# EAGLE design openTPM-v37 (EAGLE 8.4.3)
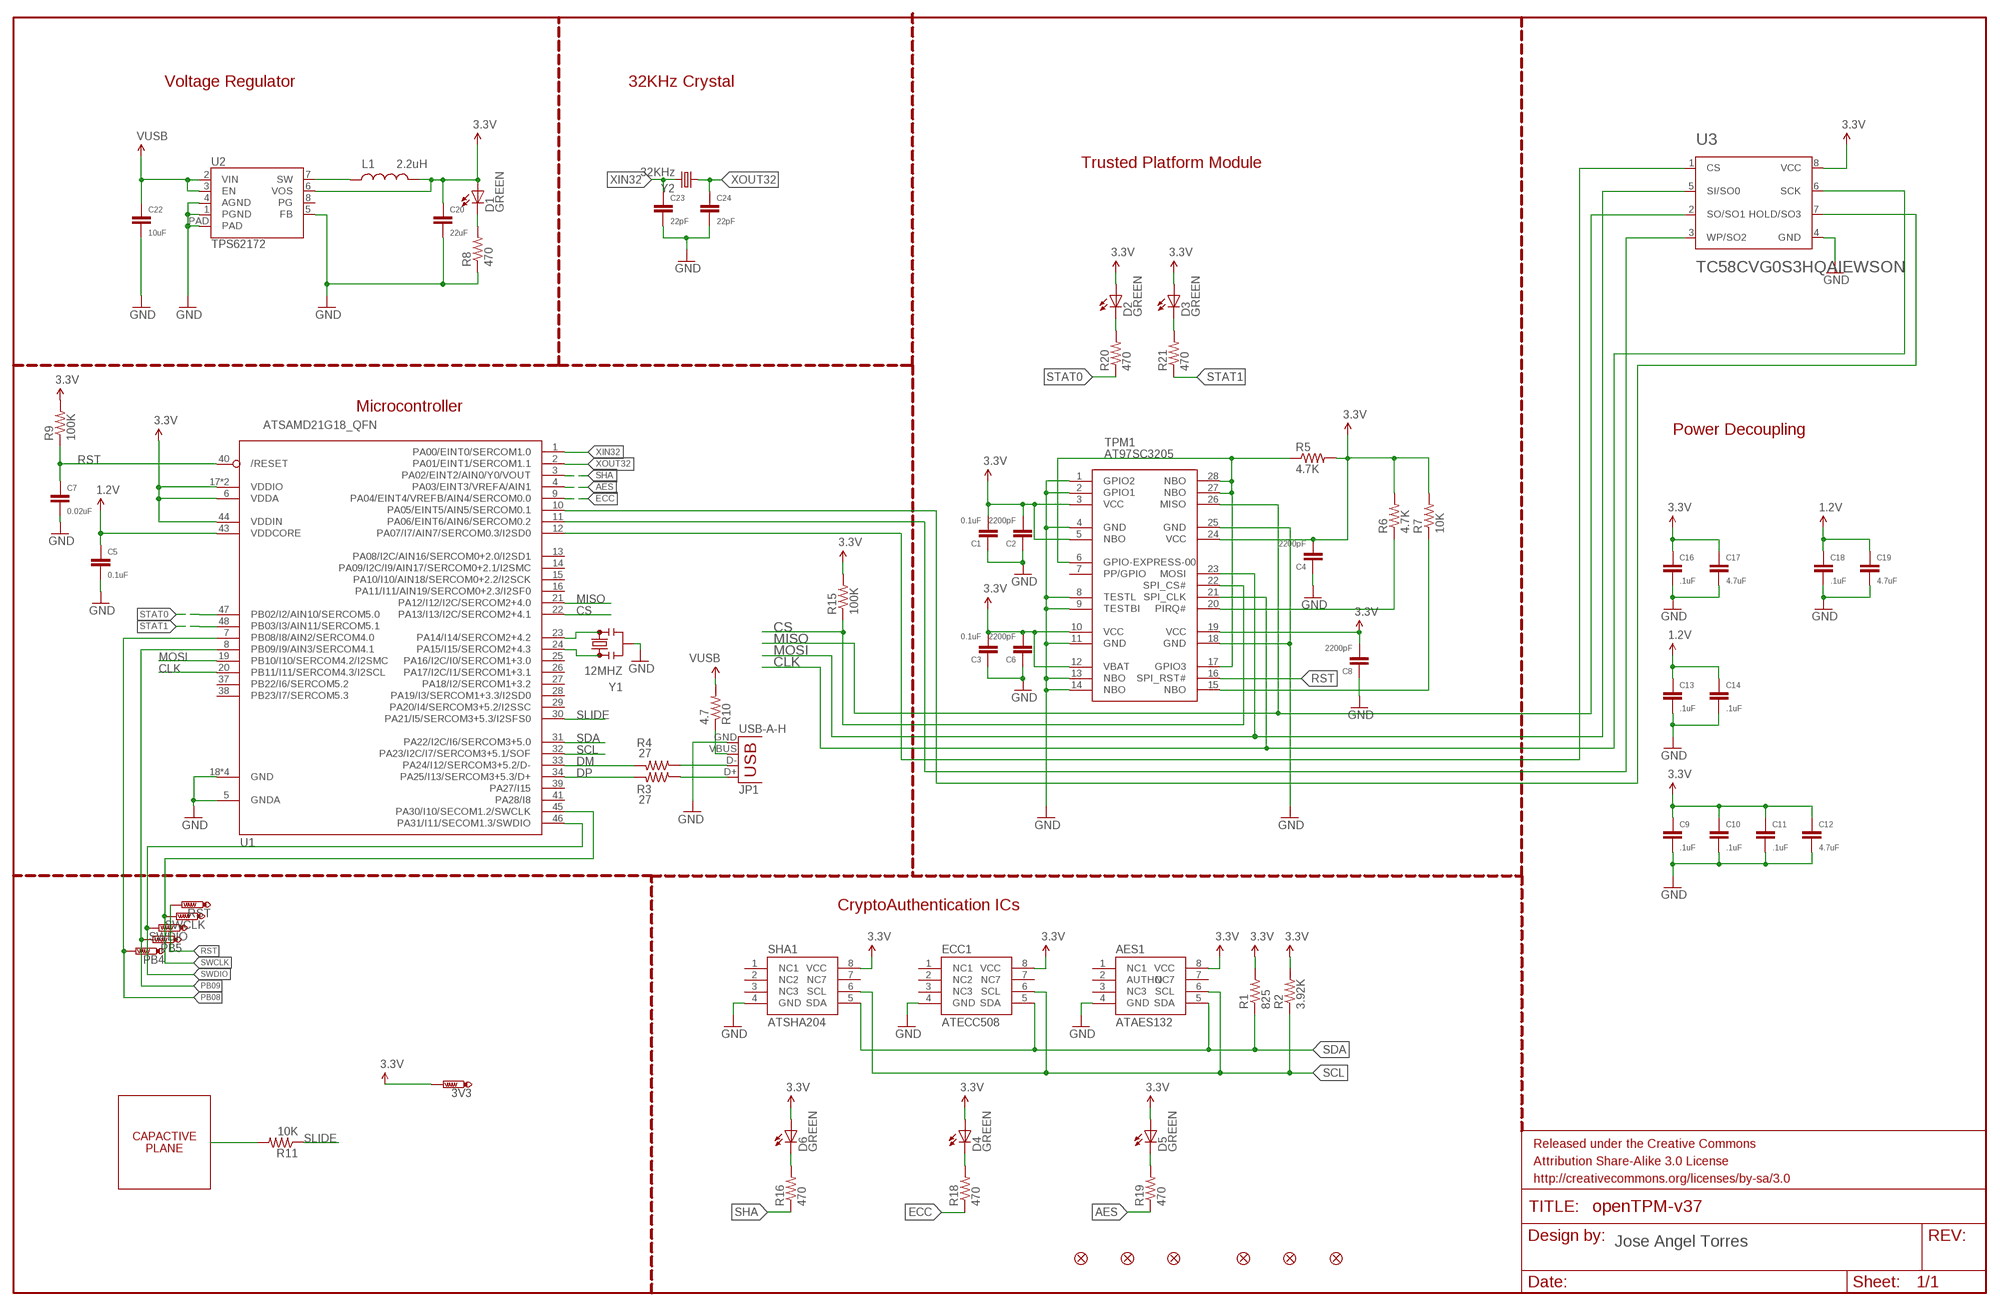
[diagram p0: schematic, sheet 1]

## Parts
3V3  PTR1B1,27  [B1,27]
AES1  ATAES132  CRYPTOTRONIX_ATAES132  [CRYPTOTRONIX_SOIC8]
C1  0.1uF  CAPACITOR.0402  [0402]
C2  2200pF  CAPACITOR.0402  [0402]
C3  0.1uF  CAPACITOR.0402  [0402]
C4  2200pF  CAPACITOR.0402  [0402]
C5  0.1uF  CAPACITOR.0402  [0402]
C6  2200pF  CAPACITOR.0402  [0402]
C7  0.02uF  CAPACITOR.0402  [0402]
C8  2200pF  CAPACITOR.0402  [0402]
C9  .1uF  CAPACITOR.0402  [0402]
C10  .1uF  CAPACITOR.0402  [0402]
C11  .1uF  CAPACITOR.0402  [0402]
C12  4.7uF  CAPACITOR.0402  [0402]
C13  .1uF  CAPACITOR.0402  [0402]
C14  .1uF  CAPACITOR.0402  [0402]
C16  .1uF  CAPACITOR.0402  [0402]
C17  4.7uF  CAPACITOR.0402  [0402]
C18  .1uF  CAPACITOR.0402  [0402]
C19  4.7uF  CAPACITOR.0402  [0402]
C20  22uF  CAPACITOR.0603  [0603]
C22  10uF  CAPACITOR.0402  [0402]
C23  22pF  CAPACITOR.0402  [0402]
C24  22pF  CAPACITOR.0402  [0402]
D1  GREEN  SPARKFUN-LED_LED-GREEN0603  [SPARKFUN-LED_LED-0603]
D2  GREEN  SPARKFUN-LED_LED-GREEN0603  [SPARKFUN-LED_LED-0603]
D3  GREEN  SPARKFUN-LED_LED-GREEN0603  [SPARKFUN-LED_LED-0603]
D4  GREEN  SPARKFUN-LED_LED-GREEN0603  [SPARKFUN-LED_LED-0603]
D5  GREEN  SPARKFUN-LED_LED-GREEN0603  [SPARKFUN-LED_LED-0603]
D6  GREEN  SPARKFUN-LED_LED-GREEN0603  [SPARKFUN-LED_LED-0603]
ECC1  ATECC508  [CRYPTOTRONIX_SOIC8]
FID1  SPARKFUN-AESTHETICS_FIDUCIAL1X2  [SPARKFUN-AESTHETICS_FIDUCIAL-1X2]
FID2  SPARKFUN-AESTHETICS_FIDUCIAL1X2  [SPARKFUN-AESTHETICS_FIDUCIAL-1X2]
FID3  SPARKFUN-AESTHETICS_FIDUCIAL1X2  [SPARKFUN-AESTHETICS_FIDUCIAL-1X2]
FID4  SPARKFUN-AESTHETICS_FIDUCIAL1X2  [SPARKFUN-AESTHETICS_FIDUCIAL-1X2]
FID5  SPARKFUN-AESTHETICS_FIDUCIAL1X2  [SPARKFUN-AESTHETICS_FIDUCIAL-1X2]
FID6  SPARKFUN-AESTHETICS_FIDUCIAL1X2  [SPARKFUN-AESTHETICS_FIDUCIAL-1X2]
JP1  USB-A-H  [USB-A-H]
L1  2.2uH  INDUCTOR0402  [C0402]
PB4  PTR1B1,27  [B1,27]
PB5  PTR1B1,27  [B1,27]
R1  825  RESISTOR.0402  [0402]
R2  3.92K  RESISTOR.0402  [0402]
R3  27  RESISTOR.0402  [0402]
R4  27  RESISTOR.0402  [0402]
R5  4.7K  RESISTOR.0402  [0402]
R6  4.7K  RESISTOR.0402  [0402]
R7  10K  RESISTOR.0402  [0402]
R8  470  RESISTOR.0402  [0402]
R9  100K  RESISTOR.0402  [0402]
R10  4.7  RESISTOR.0402  [0402]
R11  10K  RESISTOR.0402  [0402]
R15  100K  RESISTOR.0402  [0402]
R16  470  RESISTOR.0402  [0402]
R18  470  RESISTOR.0402  [0402]
R19  470  RESISTOR.0402  [0402]
R20  470  RESISTOR.0402  [0402]
R21  470  RESISTOR.0402  [0402]
RST  PTR1B1,27  [B1,27]
SHA1  ATSHA204  CRYPTOTRONIX_ATSHA204  [CRYPTOTRONIX_SOIC8]
SWCLK  PTR1B1,27  [B1,27]
SWDIO  PTR1B1,27  [B1,27]
TPM1  AT97SC3205  [TSSOP28]
U1  ATSAMD21G18_QFN  ATSAMD21G_QFN  [TQFN48_7MM]
U2  TPS62172  [WSON-8-PAD]
U3  TC58CVG0S3HQAIEWSON  [WSON-8-PAD]
Y1  12MHZ  RESONATOR12MHZ  [RESONATOR-SMD]
Y2  32KHz  CRYSTALEPSONMC146  [CRYSTAL-32KHZ-SMD_EPSON_MC146]

## Nets
1.2V: C5.1 C13.1 C14.1 C18.1 C19.1 U1.43(VDDCORE)
3.3V: 3V3.TP AES1.8(VCC) C1.2 C2.2 C3.2 C4.2 C6.2 C8.2 C9.1 C10.1 C11.1 C12.1 C16.1 C17.1 C20.1 D1.A D2.A D3.A D4.A D5.A D6.A ECC1.8(VCC) L1.2 R1.2 R2.2 R5.2 R6.2 R7.2 R9.2 R15.2 SHA1.8(VCC) TPM1.3(VCC) TPM1.5(NBO) TPM1.10(VCC) TPM1.12(VBAT) TPM1.19(VCC) TPM1.24(VCC) U1.6(VDDA) U1.17(VDDIO) U1.36(VDDIO) U1.44(VDDIN) U2.6(VOS) U3.8(VCC)
AES: R19.1 U1.4(PA03/EINT3/VREFA/AIN1)
CAP: R11.2
CLK: TPM1.21(SPI_CLK) U1.20(PB11/I11/SERCOM4.3/I2SCL) U3.6(SCK)
CS: R15.1 TPM1.22(SPI_CS#) U1.22(PA13/I13/I2C/SERCOM2+4.1)
DM: R4.2 U1.33(PA24/I12/SERCOM3+5.2/D-)
DP: R3.2 U1.34(PA25/I13/SERCOM3+5.3/D+)
ECC: R18.1 U1.9(PA04/EINT4/VREFB/AIN4/SERCOM0.0)
GND: AES1.4(GND) C1.1 C2.1 C3.1 C4.1 C5.2 C6.1 C7.2 C8.1 C9.2 C10.2 C11.2 C12.2 C13.2 C14.2 C16.2 C17.2 C18.2 C19.2 C20.2 C22.2 C23.2 C24.2 ECC1.4(GND) JP1.GND R8.1 SHA1.4(GND) TPM1.1(GPIO2) TPM1.2(GPIO1) TPM1.4(GND) TPM1.8(TESTL) TPM1.9(TESTBI) TPM1.11(GND) TPM1.13(NBO) TPM1.14(NBO) TPM1.18(GND) TPM1.25(GND) U1.5(GNDA) U1.18(GND) U1.35(GND) U1.42(GND) U1.THERMAL(GND) U2.1(PGND) U2.4(AGND) U2.5(FB) U2.PAD U3.4(GND) Y1.2
MISO: TPM1.26(MISO) U1.21(PA12/I12/I2C/SERCOM2+4.0) U3.2(SO/SO1)
MOSI: TPM1.23(MOSI) U1.19(PB10/I10/SERCOM4.2/I2SMC) U3.5(SI/SO0)
N$8: U1.24(PA15/I15/SERCOM2+4.3) Y1.1
N$9: U1.23(PA14/I14/SERCOM2+4.2) Y1.3
N$10: R6.1 TPM1.20(PIRQ#)
N$11: JP1.D- R4.1
N$12: JP1.D+ R3.1
N$13: JP1.VBUS R10.1
N$14: R7.1 TPM1.15(NBO)
N$15: R5.1 TPM1.6(GPIO-EXPRESS-00) TPM1.17(GPIO3) TPM1.27(NBO) TPM1.28(NBO)
N$16: D4.C R18.2
N$17: L1.1 U2.7(SW)
N$18: D1.C R8.2
N$19: U1.12(PA07/I7/AIN7/SERCOM0.3/I2SD0) U3.1(CS)
N$20: D6.C R16.2
N$21: D5.C R19.2
N$22: D2.C R20.2
N$23: D3.C R21.2
N$24: U1.10(PA05/EINT5/AIN5/SERCOM0.1) U3.7(HOLD/SO3)
N$25: U1.11(PA06/EINT6/AIN6/SERCOM0.2) U3.3(WP/SO2)
PB08: PB4.TP U1.7(PB08/I8/AIN2/SERCOM4.0)
PB09: PB5.TP U1.8(PB09/I9/AIN3/SERCOM4.1)
RST: C7.1 R9.1 RST.TP TPM1.16(SPI_RST#) U1.40(/RESET)
SCL: AES1.6(SCL) ECC1.6(SCL) R2.1 SHA1.6(SCL) U1.32(PA23/I2C/I7/SERCOM3+5.1/SOF)
SDA: AES1.5(SDA) ECC1.5(SDA) R1.1 SHA1.5(SDA) U1.31(PA22/I2C/I6/SERCOM3+5.0)
SHA: R16.1 U1.3(PA02/EINT2/AIN0/Y0/VOUT)
SLIDE: R11.1 U1.30(PA21/I5/SERCOM3+5.3/I2SFS0)
STAT0: R20.1 U1.47(PB02/I2/AIN10/SERCOM5.0)
STAT1: R21.1 U1.48(PB03/I3/AIN11/SERCOM5.1)
SWCLK: SWCLK.TP U1.45(PA30/I10/SECOM1.2/SWCLK)
SWDIO: SWDIO.TP U1.46(PA31/I11/SECOM1.3/SWDIO)
VUSB: C22.1 R10.2 U2.2(VIN) U2.3(EN)
XIN32: C23.1 U1.1(PA00/EINT0/SERCOM1.0) Y2.P$1
XOUT32: C24.1 U1.2(PA01/EINT1/SERCOM1.1) Y2.P$2
Unconnected: AES1.1(NC1) AES1.2(AUTHO) AES1.3(NC3) AES1.7(NC7) ECC1.1(NC1) ECC1.2(NC2) ECC1.3(NC3) ECC1.7(NC7) SHA1.1(NC1) SHA1.2(NC2) SHA1.3(NC3) SHA1.7(NC7) TPM1.7(PP/GPIO) U1.13(PA08/I2C/AIN16/SERCOM0+2.0/I2SD1) U1.14(PA09/I2C/I9/AIN17/SERCOM0+2.1/I2SMC) U1.15(PA10/I10/AIN18/SERCOM0+2.2/I2SCK) U1.16(PA11/I11/AIN19/SERCOM0+2.3/I2SF0) U1.25(PA16/I2C/I0/SERCOM1+3.0) U1.26(PA17/I2C/I1/SERCOM1+3.1) U1.27(PA18/I2/SERCOM1+3.2) U1.28(PA19/I3/SERCOM1+3.3/I2SD0) U1.29(PA20/I4/SERCOM3+5.2/I2SSC) U1.37(PB22/I6/SERCOM5.2) U1.38(PB23/I7/SERCOM5.3) U1.39(PA27/I15) U1.41(PA28/I8) U2.8(PG)

## Notes on the sheet
- Voltage Regulator | 32KHz Crystal
- Trusted Platform Module
- Microcontroller
- Power Decoupling
- CryptoAuthentication ICs
- CAPACTIVE
  PLANE
- Jose Angel Torres

## Library data of the parts
3V3 PB4 PB5 RST SWCLK SWDIO = CHEEPER-REV0.51A:PTR1: TEST PIN
AES1 = TPM:CRYPTOTRONIX_ATAES132: 32Kb Serial EEPROM. AES-128-CCM. MAC. Secure Storage for 128-bit keys. Encrypted User Memory Readn and Write. HWRNG. 2.5V to 5.5V.
C1-C14 C16-C20 C22-C24 = TPM:CAPACITOR
D1-D6 = TPM:SPARKFUN-LED_LED-GREEN: Various green LEDs 0603- DIO-00821 LARGE- DIO-00862 LILYPAD- DIO-09910; PROD_ID: DIO-00821
ECC1 = TPM:ATECC508: ATECC108: Provides ECDSA with NIST curves P256, B283, and K283. Also, a RNG, 8.5Kb EEPROM. 2.0V - 5.5V.
FID1-FID6 = TPM:SPARKFUN-AESTHETICS_FIDUCIAL: Fiducial Alignment Points Various fiducial points for machine vision alignment.
JP1 = TPM:USB: USB Connectors USB-B-PTH is fully proven SKU : PRT-00139/CONN-08278 USB-miniB is fully proven SKU : PRT-00587 USB-A-PCB is untested. USB-A-H is throughly reviewed, but untested. Spark Fun Electronics SKU : PRT-00437 USB-B-SMT is throughly reviewed, but untested. Needs silkscreen touching up. USB-A-S has not been used/tested USB-MB-H has not been used/tested USB-MICROB has been used. CONN-09505; PROD_ID: CONN-08367
L1 = TPM:INDUCTOR: Inductors Basic Inductor/Choke - 0603 and 1206. Footprints are not proven and vary greatly between part numbers. INDUCTOR POWER 3.3UH 4.0A SMD 0.197" L x 0.197" W x 0.177" H (5.00mm x 5.00mm x 4.50mm)
R1-R11 R15 R16 R18-R21 = TPM:RESISTOR
SHA1 = TPM:CRYPTOTRONIX_ATSHA204: ATSHA204
TPM1 = TPM:AT97SC3205: Atmel TPM 1.2
U1 = microbuilder:ATSAMD21G
U2 = TPM:TPS62172: Texas Instruments TPS62172 3-17V 0.5A Step-Down Converter with DCS control. Available in adjustable and fixed output voltage versions. Is packaged in an 8-pin WSON package measuring 2 × 2 mm (DSG). See a 3.3V fixed output version of this chip in action on the Electric Imp Breakout Board <https://www.sparkfun.com/products/11400>. Datasheet <http://www.ti.com/lit/gpn/tps62172>; PROD_ID: IC-11307
U3 = ALLEYBEACH_LIB:TC58CVG0S3HQAIE
Y1 = TPM:RESONATOR: Resonator Small SMD resonator. Used, eg, on the Arduino Pro/ Pro Mini boards. 8MHz- XTAL-08895 16MHz- XTAL-08900; PROD_ID: XTAL-08900; VALUE: 16MHZ
Y2 = TPM:CRYSTAL: Various standard crystals. Proven footprints.

## Board
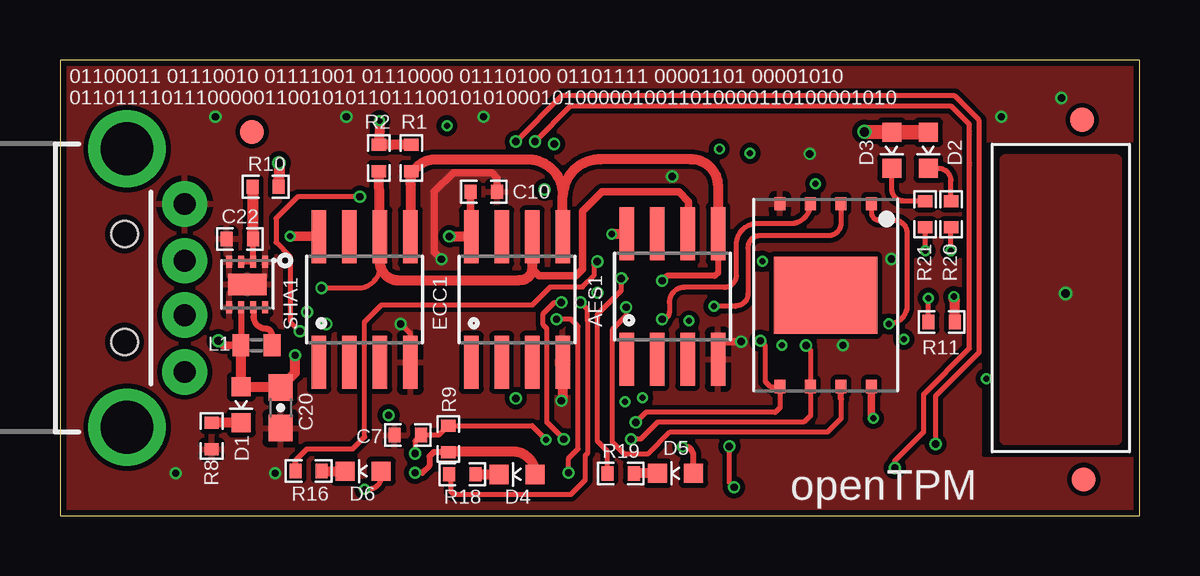
[diagram p1: board, top side]
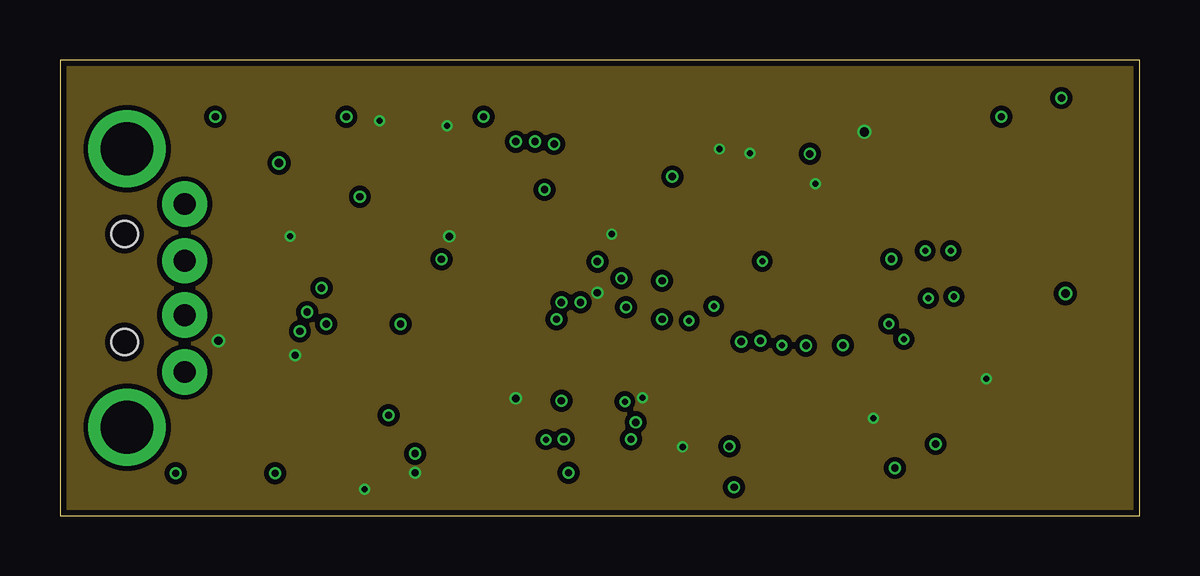
[diagram p2: board, inner layer Route2]
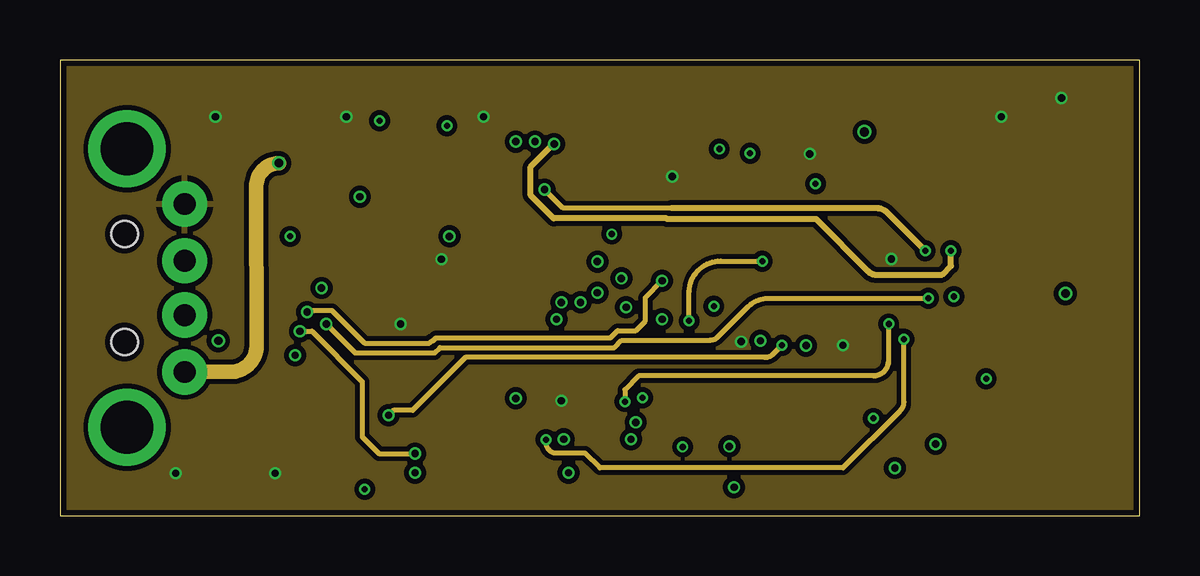
[diagram p3: board, inner layer Route15]
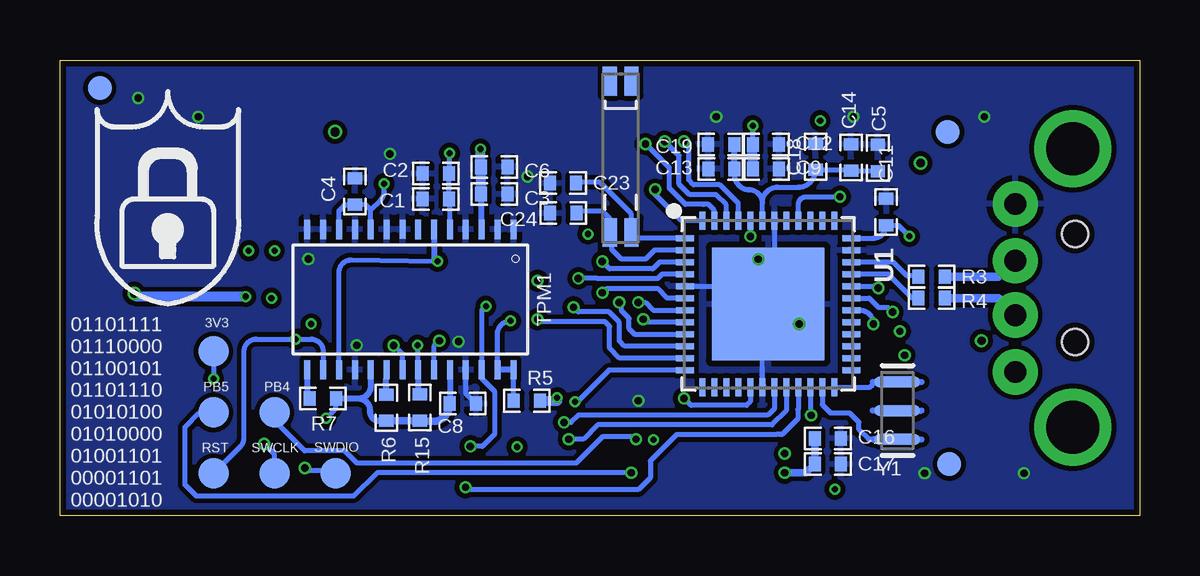
[diagram p4: board, bottom side, seen from below]

Size 45.01 x 19 mm. Coordinates in mm from the lower left corner, seen from the top.
Outline: 0,0 45.01,0 45.01,19 0,19 0,0
Copper layers (1*2*15*16): Top 0.035mm / dielectric 0.2mm / Route2 0.0175mm / dielectric 0.3mm / Route15 0.0175mm / dielectric 0.2mm / Bottom 0.035mm
Design rules "SeeedStudio_4layer_DRU_no_angle_20140221 *": minimum track width 8mil, minimum drill 10mil, track to track 8mil, track to pad 8mil, pad to pad 8mil, via to via 8mil, smd to smd 0mil, copper to edge 10mil, drill to drill 8mil, minimum pad ring 6mil, minimum via ring 4mil, stop-mask expansion 4mil, vias tented up to drill 100mil, thermal gap 10mil
tRestrict: area 38.5,2.5 to 44.8,15.5
vRestrict: area 38.5,2.5 to 44.8,15.5

### Footprints (pad centres in the part's own frame; a part is rotated, then mirrored left to right if it is on the bottom)
B1,27 = smd 1.27 x 1.27: TP 0,0
CRYPTOTRONIX_SOIC8 = smd 0.61 x 2.21: 1 -1.905,-2.616; 2 -0.635,-2.616; 3 0.635,-2.616; 4 1.905,-2.616; 5 1.905,2.616; 6 0.635,2.616; 7 -0.635,2.616; 8 -1.905,2.616
0402 = smd 0.5 x 0.6: 1 -0.55,0; 2 0.55,0
0603 = smd 1.1 x 1: 1 -0.85,0; 2 0.85,0
SPARKFUN-LED_LED-0603 = smd 0.8 x 0.8: A 0,-0.75; C 0,0.75
SPARKFUN-AESTHETICS_FIDUCIAL-1X2 = smd 1 x 1: 1 0,0
USB-A-H = drill 0.914 pad 1.88: D+ 2.4,1.127; D- 2.4,-1.127; GND 2.4,3.5; VBUS 2.4,-3.5 | drill 2.2: GND2 0,-5.8; GND3 0,5.8 | hole 1.1: -0.1,2.25; -0.1,-2.25
C0402 = smd 0.7 x 0.9: 1 -0.65,0; 2 0.65,0
TSSOP28 = smd 0.8 x 0.25: 1 -2.921,4.623; 2 -2.921,3.962; 3 -2.921,3.302; 4 -2.921,2.642; 5 -2.921,1.981; 6 -2.921,1.321; 7 -2.921,0.66; 8 -2.927,0; 9 -2.921,-0.66; 10 -2.921,-1.321; 11 -2.921,-1.981; 12 -2.921,-2.642; 13 -2.921,-3.302; 14 -2.921,-3.962; 15 2.921,-3.962; 16 2.921,-3.302; 17 2.921,-2.642; 18 2.921,-1.981; 19 2.921,-1.321; 20 2.921,-0.66; 21 2.927,0; 22 2.921,0.66; 23 2.921,1.321; 24 2.921,1.981; 25 2.921,2.642; 26 2.921,3.302; 27 2.921,3.962; 28 2.921,4.623
TQFN48_7MM = smd 0.25 x 0.75: 1 -2.75,-3.475; 2 -2.25,-3.475; 3 -1.75,-3.475; 4 -1.25,-3.475; 5 -0.75,-3.475; 6 -0.25,-3.475; 7 0.25,-3.475; 8 0.75,-3.475; 9 1.25,-3.475; 10 1.75,-3.475; 11 2.25,-3.475; 12 2.75,-3.475; 25 2.75,3.475; 26 2.25,3.475; 27 1.75,3.475; 28 1.25,3.475; 29 0.75,3.475; 30 0.25,3.475; 31 -0.25,3.475; 32 -0.75,3.475; 33 -1.25,3.475; 34 -1.75,3.475; 35 -2.25,3.475; 36 -2.75,3.475 | smd 0.75 x 0.25: 13 3.475,-2.75; 14 3.475,-2.25; 15 3.475,-1.75; 16 3.475,-1.25; 17 3.475,-0.75; 18 3.475,-0.25; 19 3.475,0.25; 20 3.475,0.75; 21 3.475,1.25; 22 3.475,1.75; 23 3.475,2.25; 24 3.475,2.75; 37 -3.475,2.75; 38 -3.475,2.25; 39 -3.475,1.75; 40 -3.475,1.25; 41 -3.475,0.75; 42 -3.475,0.25; 43 -3.475,-0.25; 44 -3.475,-0.75; 45 -3.475,-1.25; 46 -3.475,-1.75; 47 -3.475,-2.25; 48 -3.475,-2.75 | smd 4.7 x 4.7: THERMAL 0,0
WSON-8-PAD = smd 0.25 x 0.5: 1 -0.75,-0.95; 2 -0.25,-0.95; 3 0.25,-0.95; 4 0.75,-0.95; 5 0.75,0.95; 6 0.25,0.95; 7 -0.25,0.95; 8 -0.75,0.95 | smd 1.6 x 0.9: PAD 0,0
WSON-8-PAD' = smd 0.45 x 0.55: 1 -1.905,-3.81; 2 -0.635,-3.81; 3 0.635,-3.81; 4 1.905,-3.81; 5 1.905,3.81; 6 0.635,3.81; 7 -0.635,3.81; 8 -1.905,3.81 | smd 4.3 x 3.2: PAD 0,0
RESONATOR-SMD = smd 0.45 x 1.905: 1 -1.2,0; 2 0,0; 3 1.2,0
CRYSTAL-32KHZ-SMD_EPSON_MC146 = smd 1.2 x 0.6: NC1 6.9,1.2; NC2 6.9,0.3; P$1 0.6,0.3; P$2 0.6,1.2

### Placement (x,y rotation side)
3V3  38.61,6.86 0 bottom
AES1  25.53,9.14 0 top
C1  29.34,13.21 0 bottom
C2  29.34,14.26 0 bottom
C3  26.91,13.41 180 bottom
C4  32.72,13.53 270 bottom
C5  10.91,14.92 90 bottom
C6  26.91,14.54 180 bottom
C7  14.49,3.37 180 top
C8  28.22,4.69 180 bottom
C9  15.58,14.47 0 bottom
C10  17.67,13.51 0 top
C11  10.57,12.66 90 bottom
C12  15.58,15.48 0 bottom
C13  17.44,14.47 180 bottom
C14  12.03,14.93 90 bottom
C16  13,3.23 0 bottom
C17  13,2.17 0 bottom
C18  13.52,14.97 90 bottom
C19  17.45,15.48 180 bottom
C20  9.19,4.51 270 top
C22  7.49,11.54 180 top
C23  24.04,13.87 180 bottom
C24  24.03,12.62 180 bottom
D1  7.56,4.64 180 top
D2  36.2,15.24 180 top
D3  34.67,15.24 180 top
D4  19.05,1.73 90 top
D5  25.65,1.78 90 top
D6  12.64,1.87 90 top
ECC1  19.05,9.02 0 top
FID1  42.61,16.51 0 top
FID2  8,16 0 top
FID3  42.67,1.52 0 top
FID4  8,16 0 bottom
FID5  7.94,2.16 0 bottom
FID6  43.35,17.83 0 bottom
JP1  2.79,9.5 0 top
L1  8.19,7.11 180 top
PB4  36.07,4.32 270 bottom
PB5  38.61,4.32 270 bottom
R1  14.64,14.92 90 top
R2  13.3,14.92 90 top
R3  8.67,9.97 180 bottom
R4  8.67,9.08 180 bottom
R5  25.55,4.8 0 bottom
R6  31.41,4.51 270 bottom
R7  34.05,4.89 0 bottom
R8  6.32,3.33 90 top
R9  16.18,3.21 270 top
R10  8.57,13.72 180 top
R11  36.75,8.08 0 top
R15  30.01,4.52 270 bottom
R16  10.36,1.87 0 top
R18  16.78,1.74 0 top
R19  23.37,1.78 0 top
R20  37.14,12.57 90 top
R21  36.07,12.57 90 top
RST  38.61,1.78 270 bottom
SHA1  12.7,9.02 0 top
SWCLK  36.07,1.78 270 bottom
SWDIO  33.53,1.78 270 bottom
TPM1  30.73,9.02 270 bottom
U1  15.48,8.83 270 bottom
U2  7.81,9.65 180 top
U3  TC58CVG0S3HQAIEWSON  [WSON-8-PAD']  31.92,9.2 180 top
Y1  10.11,4.39 270 bottom
Y2  20.89,11.21 90 bottom

### Tracks (layer width: path | path; a pad name or v marks a point on that pad's centre or on a via)
1.2V
  Bottom 0.203: U1.43 15.73,13.04 | 15.73,13.04 arc-90 16.3,13.6 arc90 16.89,14.19 C13.1 | 15.73,13.04 15.73,13.06 arc90 15.1,13.7 14.23,13.7 arc-90 C18.1 12.07,14.42 C14.1 12.02,14.37 C5.1
  Bottom 0.254: 16.93,14.44 C13.1 16.89,15.47 C19.1
3.3V  (via drill 0.25, 0.3, 0.35, 0.38)
  Top 0.203: 9.31,5.39 C20.1 | 7.56,7.1 L1.2 7.56,7.13 | 16.18,2.69 arc-90 R9.2 | 23.04,11.76 arc90 v23,11.75 | D6.A 13.39,1.63 arc-90 12.88,1.12 v12.7,1.12 | 33.82,4.15 v33.91,4.06 | 17.1,12 17.1,12.5 | 17.1,12 17.1,11.68 arc90 ECC1.8 | 17.12,12.02 17.1,12
  Top 0.254: U2.6 7.56,7.13 | D5.A 26.4,2.47 arc49 26.23,2.86 v25.96,2.88 | R9.2 15.58,2.66 15.4,2.48 15.4,2.1 15.1,1.8 v14.8,1.8
  Top 0.305: U3.8 33.82,4.15 | C10.1 17.12,11.66 ECC1.8 | L1.2 6.79,7.11 v6.6,7.3
  Top 0.406: 9.31,5.39 D1.A 7.56,7.1 | 16.18,2.69 18.91,2.69 arc-90 D4.A | R1.2 13.84,15.46 R2.2 v13.32,16.47 | 23.04,11.76 AES1.8 | SHA1.8 v9.6,11.65 | ECC1.8 16.31,11.63 arc-90 16.26,11.69 arc45 v16.23,11.65 | C20.1 9.8,5.96 v9.8,6.7
  Top 0.61: D3.A D2.A v33.54,16
  Bottom 0.203: C8.2 28.75,4.78 28.77,4.76 | TPM1.5 28.75,13.2 arc-90 C1.2 C2.2 28.76,15.11 v28.77,15.11 | 16.25,14.4 arc-90 C9.1 | 16.14,15.32 arc90 C12.1 16.13,16.25 arc45 v16.13,16.26 | 27.43,13.2 arc-90 C3.2 | TPM1.12 33.38,12.72 33.13,12.98 C4.2 32.28,12.98 32.05,12.75 | TPM1.10 32.05,12.75 | 32.05,12.75 31.64,13.16 arc-45 31.5,13.52 v31.5,13.84 | R7.2 33.5,4.68 arc45 33.65,4.33 v33.91,4.06 | 3V3.TP v38.61,5.71 | U1.36 11.1,11.58 arc-90 C11.1 10.06,12.11 v9.6,11.65 | U1.44 v16.23,11.65 arc-90 v16.23,11.65 | U1.6 19.69,9.08 20.07,9.46 22.23,9.46 v22.39,9.3 v22.4,9.3 | U1.17 16.23,4.76 16.39,4.61 18.71,4.61 v19,4.9
  Bottom 0.254: TPM1.24 28.75,4.78 | TPM1.19 32.05,5.41 arc90 32.58,4.89 | 32.58,4.89 R7.2 | TPM1.3 27.43,13.2 | R6.2 31.7,3.96 arc90 32.08,4.34 32.08,4.39 arc-90 32.58,4.89
  Bottom 0.305: C8.2 28.77,4.63 arc90 29.46,3.94 29.98,3.94 arc90 R15.2 31.37,3.97 arc-90 R6.2 | C16.1 C17.1 13.91,1.8 v14.8,1.8
  Bottom 0.406: C9.1 16.14,15.32 | v27.48,15.29 27.48,14.34 C6.2 C3.2 | 23,11.72 v23,11.75 | R5.2 24.28,4.8 v24.28,4.93
  pour Route2: 0,19.05 0,0 45.09,0 45.09,1.4 45.59,19.05
AES  (via drill 0.3)
  Top 0.203: 23.6,9.9 v23.4,9.9 23.4,9.4 22.4,8.4 22.4,8.28 22.41,8.26 22.41,3.11 22.82,2.71 R19.1
  Bottom 0.203: U1.4 19.91,10.08 20.09,9.89 22.61,9.89 22.61,9.9 v23.4,9.9
CAP  (via drill 0.25, 0.36)
  Top 0.406: 37.33,8.1 R11.2 37.3,8.98 arc-90 v37.27,9.14
  Bottom 0.406: v37.27,9.14 41.78,9.14 arc90 v41.91,9.27
  pour Top: 44.07,14.86 39.37,14.86 39.37,3.17 44.07,3.17
CLK  (via drill 0.3)
  Top 0.203: v31.1,7.1 31.28,6.92 U3.6 31.28,4.18 31.01,3.91 24.91,3.91 24.2,3.2 v23.8,3.2
  Bottom 0.203: TPM1.21 30.73,6.73 v31.1,7.1 | U1.20 14.73,4.39 15.33,3.79 22.6,3.79 23.19,3.2 v23.8,3.2
CS  (via drill 0.25, 0.3)
  Route15 0.203: v30.1,7.11 29.74,6.75 arc-45 29.38,6.6 16.9,6.6 14.7,4.4 13.9,4.4 v13.7,4.2
  Bottom 0.203: 30.07,5.32 arc-90 R15.1 | TPM1.22 30.07,7.09 v30.1,7.11 | v13.7,4.2 13.73,4.26 U1.22
  Bottom 0.254: TPM1.22 30.07,5.32
DM
  Bottom 0.203: R4.2 9.48,9.08 10.48,10.08 U1.33
DP
  Bottom 0.203: R3.2 9.26,10 9.7,10 10.28,10.58 U1.34
ECC  (via drill 0.3)
  Top 0.203: R18.1 16.3,1.67 16.3,1 16.4,0.9 21.3,0.9 21.9,1.5 21.9,2.52 22.01,2.63 22.01,8.09 21.99,8.11 21.99,8.61 v21.7,8.9
  Bottom 0.203: U1.9 21.07,7.58 21.29,7.8 21.29,8.24 21.6,8.55 21.6,8.8 v21.7,8.9
GND  (via drill 0.3)
  Top 0.203: SHA1.4 14.61,7.59 v14.2,8 | 20.95,4.86 v20.9,4.8 | v15.9,10.7 15.67,10.93
  Top 0.305: C10.2 18.22,14.08 18,14.3 16.4,14.3 15.6,13.5 15.6,11 v15.9,10.7 | v28.4,7.26 27.46,7.26 27.4,7.2 27.4,6.56 AES1.4
  Top 0.406: ECC1.4 20.95,4.86
  Bottom 0.203: U1.5 16.23,9.58 15.78,9.12 | 15.78,9.12 U1.THERMAL 15.73,8.58 | U1.18 15.73,8.58 | 15.73,8.58 14.78,8.58 v14.2,8 | TPM1.25 28.09,5.11 C8.1 | U1.42 15.23,10.56 15.5,10.3 15.5,9.4 15.78,9.12
  other vias: 32.64,7.11 6.48,16.64 11.94,16.64 17.65,16.64 39.24,16.64 41.74,17.42 25.52,14.14 31.25,15.09 34.66,10.71 4.83,1.78 8.97,1.78
  pour Bottom: -0.13,19.05 46.1,19.05 45.09,0 0,0
  pour Top (rank 2): 0,19.05 0,0 45.09,0 45.09,1.4 46.61,19.05
  pour Route15: 0,19.05 0,0 45.09,0 47.12,19.05
MISO  (via drill 0.25, 0.3)
  Top 0.203: U3.2 32.55,12.19 arc-90 32.05,11.68 29.18,11.68 arc90 28.68,11.18 28.68,9.25 arc-90 28.19,8.76 28.17,8.74 v27.25,8.74 | v28.1,1.2 27.9,1.4 v27.9,2.9
  Bottom 0.203: v27.25,8.74 27.43,8.56 TPM1.26 27.43,5.73 26.9,5.2 26.9,3.4 27.4,2.9 v27.9,2.9 | U1.21 14.23,4.46 14.26,4.43 14.26,4.04 14.9,3.4 15,3.4 15.15,3.4 15.16,3.39 19.31,3.39 20.04,2.65 20.05,2.65 20.4,2.3 20.4,1.6 20.9,1.1 27.9,1.1 v28.1,1.2
MOSI  (via drill 0.3)
  Top 0.203: v29.2,7.3 29.4,7.1 29.4,5.6 29.61,5.39 U3.5 30.01,4.51 29.81,4.31 24.41,4.31 24.41,4.3 v24,3.9
  Bottom 0.203: TPM1.23 29.41,7.09 v29.2,7.3 | U1.19 15.23,4.46 15.5,4.2 23.4,4.2 23.7,3.9 v24,3.9
N$8
  Bottom 0.203: U1.24 11.35,5.35 arc-90 11.1,5.6 11.12,5.6 arc-90 11.12,5.59
N$9
  Bottom 0.203: U1.23 13.23,4.63 12.9,4.3 12.1,4.3 11.7,3.9 11.7,3.6 11.29,3.19 Y1.3
N$10
  Bottom 0.203: 31.4,6.08 TPM1.20
  Bottom 0.254: R6.1 31.41,5.4 31.4,6.08
N$11
  Bottom 0.356: R4.1 5.9,9.08 JP1.D-
N$12
  Bottom 0.356: R3.1 5.9,9.97 JP1.D+
N$13  (via drill 0.36)
  Top 0.457: v9.13,14.71 R10.1
  Route15 0.61: JP1.VBUS 7.09,6 arc90 8.2,7.11 8.18,13.7 arc-90 v9.13,14.71
N$14
  Bottom 0.254: TPM1.15 34.7,4.99 arc-90 R7.1
N$15  (via drill 0.25)
  Route15 0.203: v26.23,8.13 26.23,9.35 arc-90 27.55,10.62 v29.27,10.62
  Bottom 0.203: R5.1 TPM1.28 | TPM1.27 26.77,7.58 arc90 v26.23,8.13 | 29.4,11.93 arc-90 TPM1.6 | TPM1.17 33.38,10.16 arc90 32.87,10.67 v29.27,10.62
  Bottom 0.254: TPM1.28 TPM1.27 | v29.27,10.62 29.34,10.67 29.4,10.73 29.4,11.93
N$16
  Top 0.203: 18.31,1.74 D4.C
  Top 0.406: R18.2 18.31,1.74
N$17
  Top 0.203: U2.7 | 8.83,7.13 L1.1
  Top 0.254: U2.7 8.06,8.32 arc90 8.57,7.81 arc-90 8.83,7.56 8.83,7.13
N$18
  Top 0.203: 6.38,3.88 R8.2
  Top 0.406: D1.C 6.38,3.88
N$19  (via drill 0.25)
  Top 0.203: U3.1 33.82,12.66 arc90 34.16,12.32 34.8,12.32 arc-90 35.31,11.81 35.31,8.76 arc-90 v34.54,8
  Route15 0.203: v34.54,8 34.54,6.48 arc-90 33.91,5.84 24.12,5.84 23.54,5.27 v23.54,4.77
  Bottom 0.203: U1.12 22.13,6.08 23.44,4.77 v23.54,4.77
N$20
  Top 0.406: R16.2 D6.C
N$21
  Top 0.406: D5.C R19.2
N$22
  Top 0.203: R20.2 37.14,13.97 arc90 36.63,14.48 36.21,14.48 D2.C
N$23
  Top 0.203: R21.2 35.18,13.12 arc-90 34.67,13.63 D3.C
N$24  (via drill 0.3)
  Top 0.203: U3.7 32.55,4.05 32,3.5 25.43,3.5 24.53,2.6 23.5,2.6 23.01,3.09 23.01,4.99 23.01,5.8 | v23.6,8.7 23.6,8.35 23.01,7.76 23.01,5.8 | 23.01,5.8 23.01,5.49
  Top 0.254: 32.55,4.87 U3.7
  Bottom 0.203: U1.10 21.47,7.08 21.69,7.3 21.69,8.07 22.13,8.51 23.41,8.51 v23.6,8.7
N$25  (via drill 0.3)
  Top 0.203: U3.3 arc-90 30.46,12.19 29.08,12.19 arc90 28.19,11.3 28.19,10.03 arc-90 27.69,9.53 26.02,9.53 arc90 25.4,8.9 25.4,8.5 arc-90 v25.1,8.2
  Bottom 0.203: U1.11 21.68,6.58 22.1,7 22.1,7.9 22.3,8.1 25,8.1 arc90 v25.1,8.2
PB08  (via drill 0.3)
  Top 0.203: v21,3.2 20.8,3.4 20.8,3.41 20.3,3.9 20.3,7.81 20.14,7.97 20.14,8.43 20.5,8.79 20.61,8.9 v20.9,8.9
  Bottom 0.203: PB4.TP 36.07,3.97 34.82,2.72 33.14,2.72 32.63,2.21 23.49,2.21 22.4,3.3 21.1,3.3 v21,3.2 | U1.7 20.29,8.58 20.61,8.9 v20.9,8.9
PB09  (via drill 0.3)
  Top 0.203: v20.7,8.2 21.3,8.2 21.6,7.9 21.6,2.8 21.2,2.4 v21.2,1.8
  Bottom 0.203: PB5.TP 38.63,4.3 39.2,4.3 39.8,3.7 39.8,1.3 39.34,0.84 32.76,0.84 31.8,1.8 v21.2,1.8 | v20.7,8.2 20.58,8.08 U1.8
RST  (via drill 0.25, 0.3)
  Top 0.203: R9.1 16.08,3.78 | v20.26,3.19 19.69,3.76 R9.1 | R9.1 15.79,3.37 C7.1 14.8,3.13 v14.8,2.6 | v12.5,13.3 9.9,13.3 9,12.4 9,11.4 9.6,10.8 9.6,8.1 v10,7.7
  Route15 0.203: v35.18,7.37 35.18,4.75 arc-45 35.03,4.39 32.64,2 22.5,2 21.88,2.62 20.7,2.62 arc-90 20.26,3.05 v20.26,3.19 | v10,7.7 10.5,7.7 12.6,5.6 12.6,3.3 13.3,2.6 v14.8,2.6
  Bottom 0.203: TPM1.16 34.04,6.86 arc-90 34.54,7.37 v35.18,7.37 36.83,7.37 arc-90 37.34,6.86 37.34,3.26 arc45 37.49,2.9 RST.TP | U1.40 14.23,12.96 arc90 13.9,13.3 v12.5,13.3
SCL  (via drill 0.3)
  Top 0.203: 13.31,14.28 arc-90 R2.1 | v10.9,9.5 12.59,9.5 arc90 13.34,10.65
  Top 0.305: AES1.6 26.2,11.8 26.2,13.1 25.8,13.5 22.6,13.5 21.79,12.69 21.79,10.29 21.5,10 19.98,10 19.68,10.29
  Top 0.406: 13.31,14.28 SHA1.6 13.34,10.65 arc90 14.03,9.82 19.15,9.82 arc90 19.68,10.29 ECC1.6
  Bottom 0.203: U1.32 11.08,9.58 arc90 v10.9,9.5
SDA  (via drill 0.3)
  Top 0.203: R1.1 14.61,13.85 arc-90 14.61,13.84
  Top 0.254: AES1.5 27.43,10.13 27.3,10 25.3,10 v25.1,9.8
  Top 0.406: AES1.5 27.43,13.78 arc90 26.29,14.86 22.54,14.86 arc90 20.95,13.34 | SHA1.5 14.61,13.84 arc-90 15.62,14.86 19.56,14.86 arc-90 20.95,13.34 | ECC1.5 20.95,13.34
  Route15 0.203: v25.1,9.8 24.4,9.1 24.4,8.12 24,7.72 23.25,7.72 22.95,7.42 15.84,7.42 15.68,7.42 15.67,7.42 15.56,7.3 15.55,7.3 15.49,7.3 15.4,7.21 12.69,7.21 11.34,8.56 10.36,8.56 v10.3,8.5
  Bottom 0.203: U1.31 11.27,9.08 10.88,8.69 10.49,8.69 v10.3,8.5
SHA  (via drill 0.3)
  Top 0.203: R16.1 arc90 R16.1 9.82,2.1 | 9.81,2.21 9.81,2.31 10.3,2.8 12.2,2.8 12.7,3.3 12.7,8.1 13.4,8.8 19.7,8.8 20.44,9.54 21.79,9.54 22.26,10.01 22.26,10.46 v22.4,10.6
  Top 0.254: R16.1 9.81,2.21
  Bottom 0.203: U1.3 20.02,10.58 20.3,10.3 22.1,10.3 v22.4,10.6
SLIDE  (via drill 0.25, 0.3)
  Top 0.203: R11.1 v36.2,9.07
  Route15 0.203: v36.2,9.07 29.51,9.07 arc45 28.7,8.73 27.43,7.46 arc-45 27.07,7.32 23.41,7.32 23.11,7.01 15.84,7.01 15.62,6.8 12.3,6.8 v11.1,8
  Bottom 0.203: U1.30 11.68,8.58 arc90 v11.1,8
STAT0  (via drill 0.25, 0.3)
  Top 0.203: v37.14,11.05 R20.1
  Route15 0.254: v20.6,15.5 20.6,15.53 19.62,14.54 19.62,13.36 20.58,12.39 25.29,12.39 25.31,12.37 31.52,12.37 33.69,10.21 arc45 33.95,10.06 36.77,10.06 37.14,10.42 v37.14,11.05
  Bottom 0.203: v20.6,15.5 19.61,14.51 19.61,13.66 18.94,12.99 18.19,12.99 18.18,12.98 17.98,12.98 17.73,12.73 U1.47
STAT1  (via drill 0.25, 0.3)
  Top 0.203: v36.07,11.05 R21.1
  Route15 0.203: v20.2,13.6 20.97,12.83 25.5,12.83
  Route15 0.254: v36.07,11.05 34.44,12.68 arc45 34.08,12.83 25.5,12.83
  Bottom 0.203: U1.48 19.1,12.3 20.2,13.4 v20.2,13.6
SWCLK  (via drill 0.3)
  Top 0.203: v36.5,3 36.5,5 38.32,6.82 38.32,16.48 37.3,17.5 20.9,17.5 v19,15.6
  Bottom 0.203: U1.45 16.73,13.04 17.05,13.35 17.5,13.8 18.6,13.8 18.8,14 18.8,15.4 v19,15.6 | SWCLK.TP 36.07,2.57 v36.5,3
SWDIO  (via drill 0.3)
  Top 0.203: v34.8,2 34.8,2.3 36,3.5 36,5.08 37.91,6.98 37.91,14.6 37.91,14.71 37.91,15.9 | 37.91,15.9 37.91,16.02 | 37.91,15.9 37.91,16.32 37.16,17.06 21.26,17.06 v19.8,15.6
  Bottom 0.203: U1.46 17.23,12.96 17.67,13.39 18.77,13.39 19.21,13.83 19.21,15.02 19.34,15.15 19.36,15.15 v19.8,15.6 | 33.42,1.88 34.68,1.88 v34.8,2
  Bottom 0.254: SWDIO.TP 33.42,1.88
VUSB
  Top 0.203: 8.04,13.57 arc90 R10.2 | C22.1 8.04,11.63 arc90 8.06,11.61
  Top 0.254: U2.3 U2.2 8.06,11.61
  Top 0.457: C22.1 8.04,13.57
XIN32
  Bottom 0.203: U1.1 20.96,11.58 Y2.P$1 21.19,12.59 22.5,13.9 23.46,13.9 C23.1
XOUT32
  Bottom 0.203: U1.2 20.22,11.08 20.59,10.71 21.61,10.71 22,11.1 22,11.72 Y2.P$2 22.09,12.39 22.4,12.7 23.4,12.7 C24.1

### Text on the board
tPlace: 01100011 01110010 01111001 01110000 01110100 01101111 00001101 00001010 | 011011110111000001100101011011100101010001010000010011010000110100001010
bPlace: 01101111 / 01110000 / 01100101 / 01101110 / 01010100 / 01010000 / 01001101 / 00001101 / 00001010
tNames: openTPM